# Altium schematic sheet IMU.SchDoc: =project_title
size Tabloid; CompanyName: Luxonis Holding; Organization: Luxonis Holding; Address1: 1925 Harmony Park Drive; Address2: Westminster, CO; Address3: 80234; Address4: United States; SheetNumber: 9; SheetTotal: 14
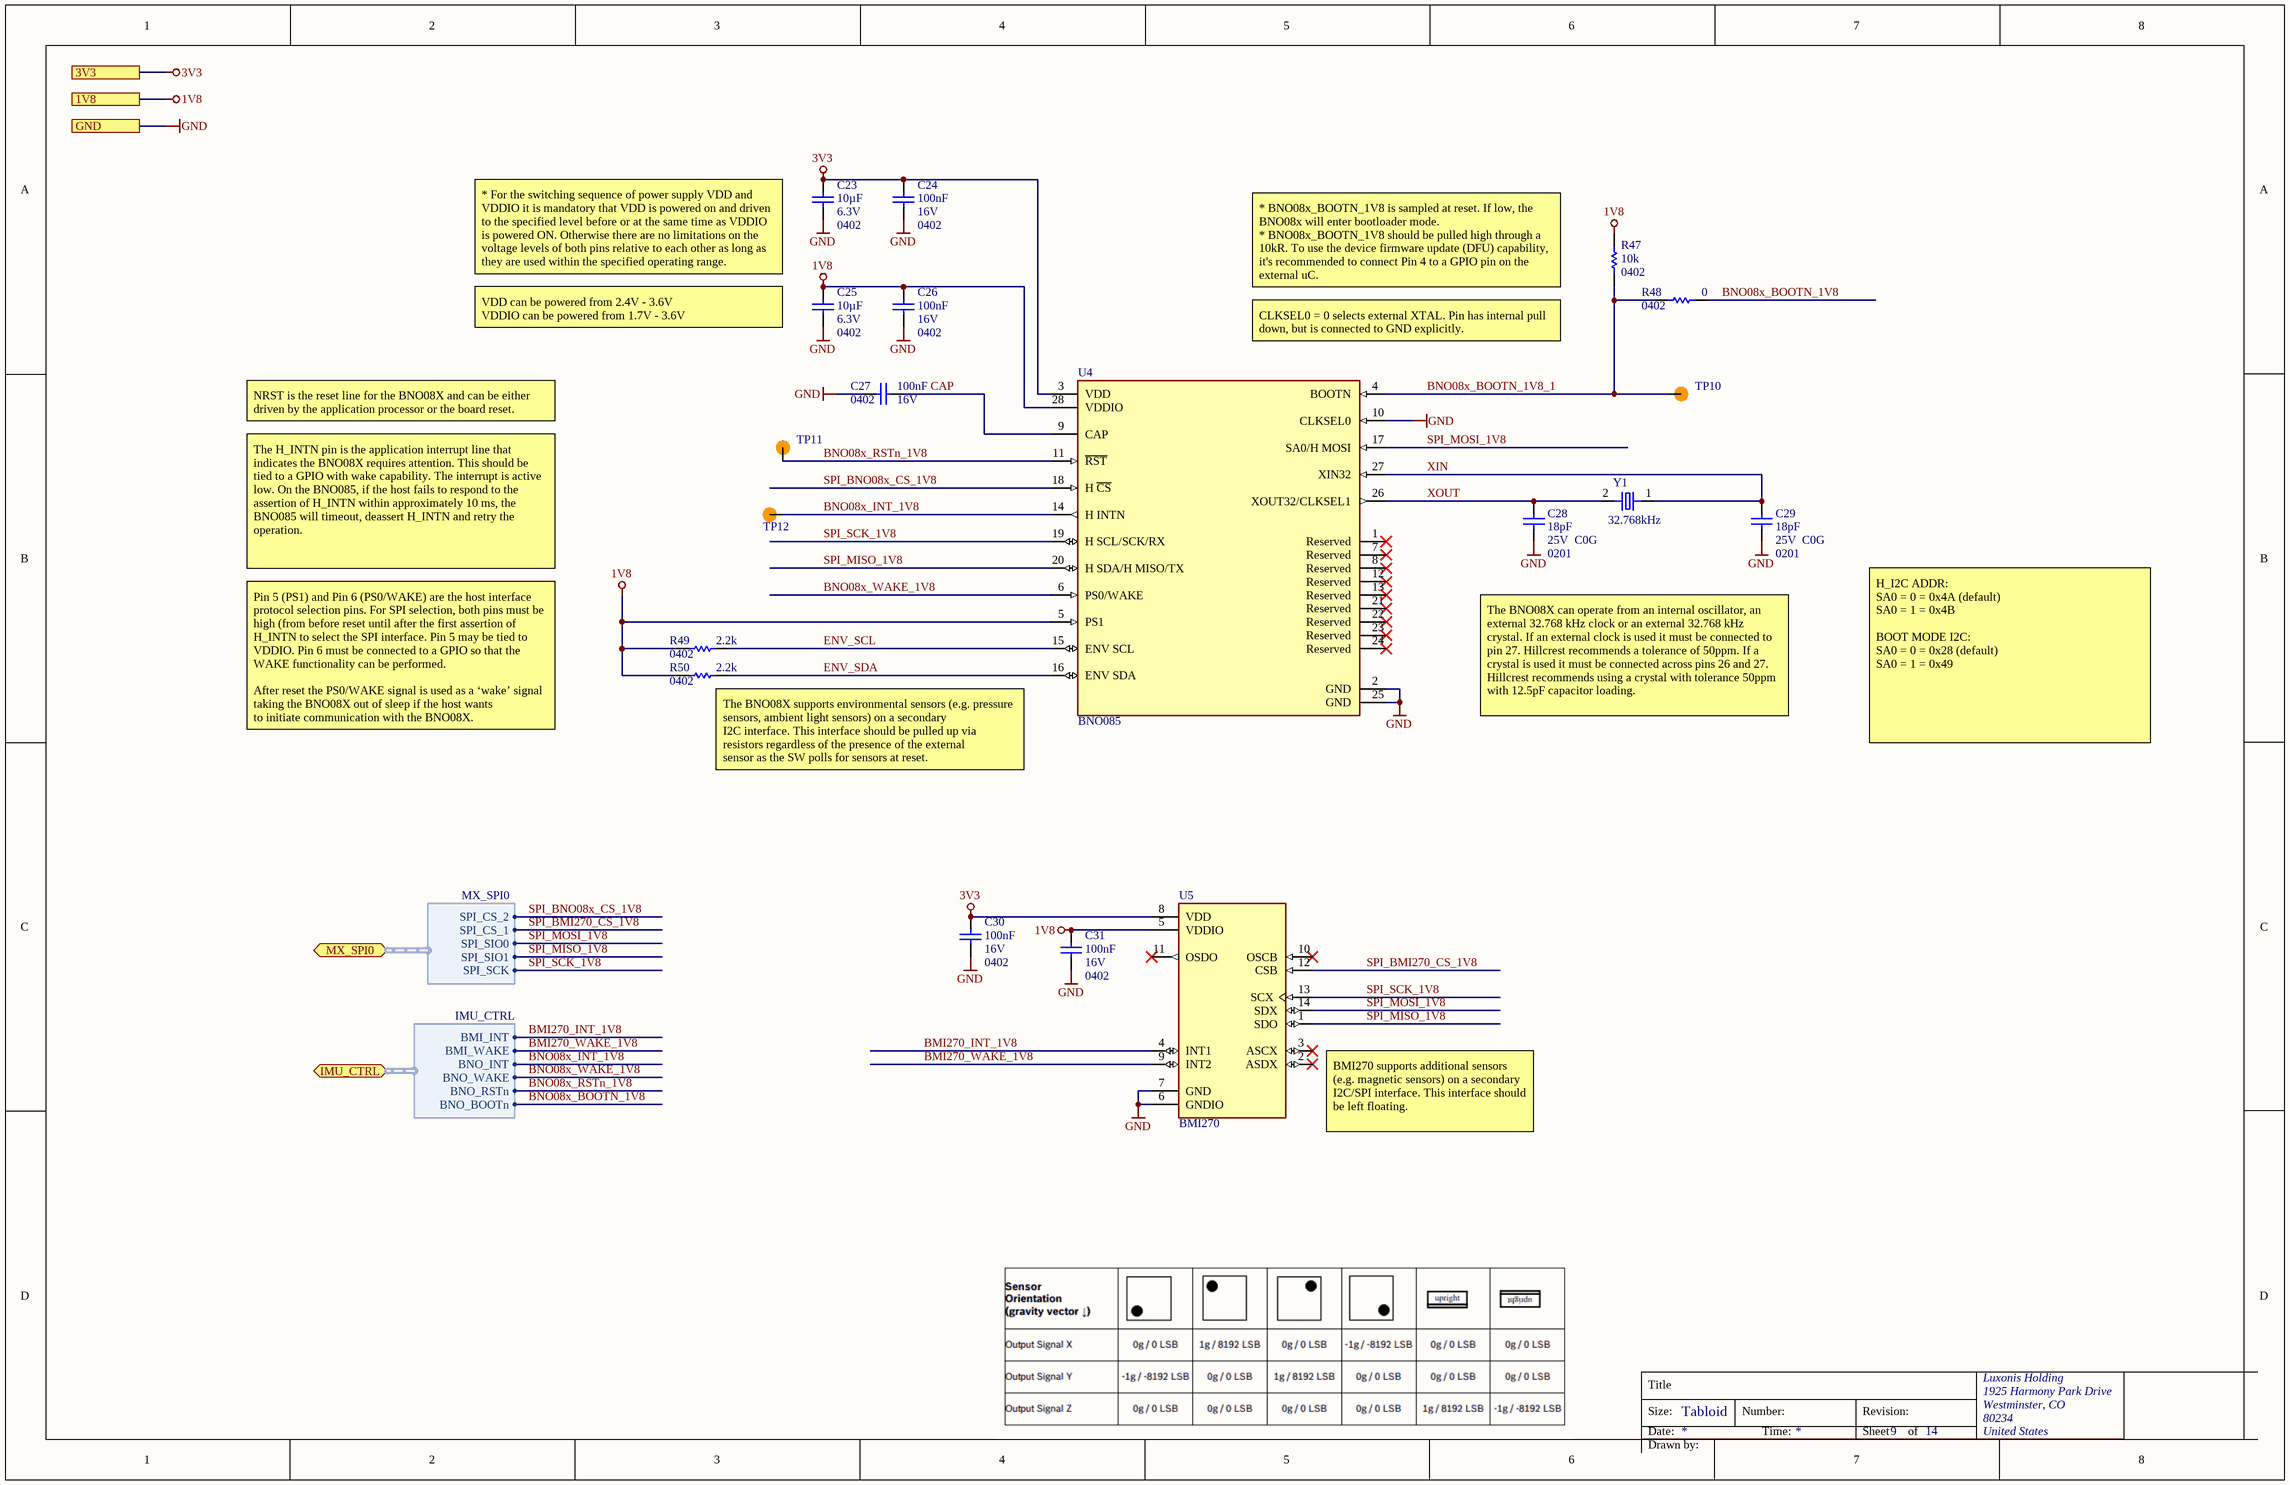
[diagram p0: IMU.SchDoc]

## Parts
C23  value 10µF  Voltage Rating: 6.3V  Case/Package: 0402  [CAPC0402(1005)70_N]  (hidden comment: GRM155R60J106ME15D)
C24  value 100nF  Voltage Rating: 16V  Case/Package: 0402  [CAPC0402(1005)60_N]  (hidden comment: CL05B104KO5NFNC)
C25  value 10µF  Voltage Rating: 6.3V  Case/Package: 0402  [CAPC0402(1005)70_N]  (hidden comment: GRM155R60J106ME15D)
C26  value 100nF  Voltage Rating: 16V  Case/Package: 0402  [CAPC0402(1005)60_N]  (hidden comment: CL05B104KO5NFNC)
C27  value 100nF  Voltage Rating: 16V  Case/Package: 0402  [CAPC0402(1005)60_N]  (hidden comment: CL05B104KO5NFNC)
C28  value 18pF  Case/Package: 0201  Voltage Rating: 25V  Dielectric: C0G  [CAPC0201(0603)33_L]  (hidden comment: GRM0335C1E180FA01D)
C29  value 18pF  Case/Package: 0201  Voltage Rating: 25V  Dielectric: C0G  [CAPC0201(0603)33_L]  (hidden comment: GRM0335C1E180FA01D)
C30  value 100nF  Voltage Rating: 16V  Case/Package: 0402  [CAPC0402(1005)60_N]  (hidden comment: CL05B104KO5NFNC)
C31  value 100nF  Voltage Rating: 16V  Case/Package: 0402  [CAPC0402(1005)60_N]  (hidden comment: CL05B104KO5NFNC)
R47  value 10k  Case/Package: 0402  [RESC0402(1005)_N]  (hidden comment: RC0402FR-1310KL)
R48  value 0  Case/Package: 0402  [RESC0402(1005)_L]  (hidden comment: CRCW04020000Z0ED)
R49  value 2.2k  Case/Package: 0402  [RESC0402(1005)_L]  (hidden comment: RC0402FR-072K2L)
R50  value 2.2k  Case/Package: 0402  [RESC0402(1005)_L]  (hidden comment: RC0402FR-072K2L)
TP10  TEST_POINT  [TP075_150_NS]  (value not drawn)  (no BOM)
TP11  TEST_POINT  [TP075_150_NS]  (value not drawn)  (no BOM)
TP12  TEST_POINT  [TP075_150_NS]  (value not drawn)  (no BOM)
U4  BNO085  [BNO085]
U5  BMI270  [XDCR_BMI270]
Y1  Frequency: 32.768kHz  [ABS06-127-32.768KHZ-T]  (hidden comment: ABS06-127-32.768KHZ-T)

## Ports
1V8, 3V3, GND, IMU_CTRL (bidir, harness IMU_CTRL), MX_SPI0 (bidir, harness MX_SPI0)

## Harnesses
MX_SPI0: SPI_SIO0, SPI_SIO1, SPI_CS_1, SPI_SCK, SPI_CS_2
IMU_CTRL: BMI_INT, BMI_WAKE, BNO_INT, BNO_WAKE, BNO_RSTn, BNO_BOOTn

## Nets
1V8: C25.2 C26.2 C31.2 R47.2 R49.1 R50.1 U4.5(PS1) U4.28(VDDIO) U5.5(VDDIO) ; port 1V8
3V3: C23.2 C24.2 C30.2 U4.3(VDD) U5.8(VDD) ; port 3V3
GND: C23.1 C24.1 C25.1 C26.1 C27.2 C28.1 C29.1 C30.1 C31.1 U4.2(GND) U4.10(CLKSEL0) U4.25(GND) U5.6(GNDIO) U5.7(GND) ; port GND
BMI270_INT_1V8: U5.4(INT1) ; port IMU_CTRL.BMI_INT
BMI270_WAKE_1V8: U5.9(INT2) ; port IMU_CTRL.BMI_WAKE
BNO08x_BOOTN_1V8: R48.2 ; port IMU_CTRL.BNO_BOOTn
BNO08x_BOOTN_1V8_1: R47.1 R48.1 TP10.1 U4.4(BOOTN)
BNO08x_INT_1V8: TP12.1 U4.14(H_INTN) ; port IMU_CTRL.BNO_INT
BNO08x_RSTn_1V8: TP11.1 U4.11(~{RST}) ; port IMU_CTRL.BNO_RSTn
BNO08x_WAKE_1V8: U4.6(PS0/WAKE) ; port IMU_CTRL.BNO_WAKE
CAP: C27.1 U4.9(CAP)
ENV_SCL: R49.2 U4.15(ENV_SCL)
ENV_SDA: R50.2 U4.16(ENV_SDA)
SPI_BMI270_CS_1V8: U5.12(CSB) ; port MX_SPI0.SPI_CS_1
SPI_BNO08x_CS_1V8: U4.18(H_~{CS}) ; port MX_SPI0.SPI_CS_2
SPI_MISO_1V8: U4.20(H_SDA/H_MISO/TX) U5.1(SDO) ; port MX_SPI0.SPI_SIO1
SPI_MOSI_1V8: U4.17(SA0/H_MOSI) U5.14(SDX) ; port MX_SPI0.SPI_SIO0
SPI_SCK_1V8: U4.19(H_SCL/SCK/RX) U5.13(SCX) ; port MX_SPI0.SPI_SCK
XIN: C29.2 U4.27(XIN32) Y1.1
XOUT: C28.2 U4.26(XOUT32/CLKSEL1) Y1.2

Not connected (* = marked no-connect by the designer): U4 1(Reserved)* 7(Reserved)* 8(Reserved)* 12(Reserved)* 13(Reserved)* 21(Reserved)* 22(Reserved)* 23(Reserved)* 24(Reserved)*; U5 2(ASDX)* 3(ASCX)* 10(OSCB)* 11(OSDO)*

## Notes on the sheet
- * For the switching sequence of power supply VDD and VDDIO it is mandatory that VDD is powered on and driven to the specified level before or at the same time as VDDIO is powered ON. Otherwise there are no limitations on the voltage levels of both pins relative to each other as long as they are used within the specified operating range.
- * BNO08x_BOOTN_1V8 is sampled at reset. If low, the BNO08x will enter bootloader mode.
  * BNO08x_BOOTN_1V8 should be pulled high through a 10kR. To use the device firmware update (DFU) capability, it's recommended to connect Pin 4 to a GPIO pin on the external uC.
- (near C25) VDD can be powered from 2.4V - 3.6V
  VDDIO can be powered from 1.7V - 3.6V
- CLKSEL0 = 0 selects external XTAL. Pin has internal pull down, but is connected to GND explicitly.
- NRST is the reset line for the BNO08X and can be either driven by the application processor or the board reset.
- The H_INTN pin is the application interrupt line that indicates the BNO08X requires attention. This should be tied to a GPIO with wake capability. The interrupt is active low. On the BNO085, if the host fails to respond to the assertion of H_INTN within approximately 10 ms, the BNO085 will timeout, deassert H_INTN and retry the operation.
- Pin 5 (PS1) and Pin 6 (PS0/WAKE) are the host interface protocol selection pins. For SPI selection, both pins must be high (from before reset until after the first assertion of H_INTN to select the SPI interface. Pin 5 may be tied to VDDIO. Pin 6 must be connected to a GPIO so that the WAKE functionality can be performed.
  After reset the PS0/WAKE signal is used as a ‘wake’ signal taking the BNO08X out of sleep if the host wants
  to initiate communication with the BNO08X.
- (near R50) The BNO08X supports environmental sensors (e.g. pressure sensors, ambient light sensors) on a secondary
  I2C interface. This interface should be pulled up via resistors regardless of the presence of the external
  sensor as the SW polls for sensors at reset.
- The BNO08X can operate from an internal oscillator, an external 32.768 kHz clock or an external 32.768 kHz crystal. If an external clock is used it must be connected to pin 27. Hillcrest recommends a tolerance of 50ppm. If a crystal is used it must be connected across pins 26 and 27. Hillcrest recommends using a crystal with tolerance 50ppm with 12.5pF capacitor loading.
- H_I2C ADDR:
  SA0 = 0 = 0x4A (default)
  SA0 = 1 = 0x4B
  BOOT MODE I2C:
  SA0 = 0 = 0x28 (default)
  SA0 = 1 = 0x49
- (near U5) BMI270 supports additional sensors (e.g. magnetic sensors) on a secondary I2C/SPI interface. This interface should be left floating.
- Title
- Size:
- Date:
- Tabloid
- Number:
- Time:
- Revision:
- Sheet
- of
- Drawn by:

## Library data of the parts
C23 C25 = CMP-004-000009-5: CAP CER 10UF 6.3V X5R 0402 20%; Manufacturer 1: Murata; Dielectric: X5R; Manufacturer Part Number 1: GRM155R60J106ME15D; ComponentLink1URL: https://www.murata.com/~/media/webrenewal/support/library/catalog/products/capacitor/mlcc/c02e.ashx?la=en-us&src-supplier=Digi-Key; Design Item ID: GRM155R60J106ME15D; Tolerance: 20%; Width: 0.02inch; Length: 0.039inch; Mounting Technology: SMT; Min Operating Temperature: -55°C; Max Operating Temperature: 85°C; ComponentLink1Description: https://www.murata.com/~/media/webrenewal/support/library/catalog/products/capacitor/mlcc/c02e.ashx?la=en-us&src-supplier=Digi-Key
C24 C26 C27 C30 C31 = CMP-108-000002-6: CAP CER 0.1UF 16V X7R 0402 10%; Manufacturer 1: Samsung; ComponentLink1URL: https://datasheet.ciiva.com/25767/cl05b104ko5nfnc-25767124.pdf?src-supplier=Digi-Key; Length: 1mm; Design Item ID: CL05B104KO5NFNC; Tolerance: 10%; Min Operating Temperature: -55°C; Width: 0.02inch; Dielectric: X7R; ComponentLink1Description: https://datasheet.ciiva.com/25767/cl05b104ko5nfnc-25767124.pdf?src-supplier=Digi-Key; Height: 0.5mm; Depth: 0.5mm; Manufacturer Part Number 1: CL05B104KO5NFNC; Max Operating Temperature: 125°C; Mounting Technology: SMT
C28 C29 = CMP-004-000003-6: CAP CER 18PF 25V C0G 0201 10%; Manufacturer 1: Murata; Tolerance: 1%; Manufacturer Part Number 1: GRM0335C1E180FA01D; Min Operating Temperature: -55°C; Max Operating Temperature: 125°C; Length: 0.024inch; Height: 0.3mm; Width: 0.3mm; ComponentLink1URL: https://datasheet.ciiva.com/29538/partnumbering-e-01-29538328.pdf?src-supplier=Digi-Key; ComponentLink1Description: https://datasheet.ciiva.com/29538/partnumbering-e-01-29538328.pdf?src-supplier=Digi-Key; Design Item ID: GRM0335C1E180FA01D; Mounting Technology: SMT
R47 = CMP-115-000004-8: RES SMD 10K OHM 1% 1/16W 0402; Manufacturer 1: Yageo; Temperature Coefficient: 100ppm/°C; Power Rating: 62.5mW; Voltage Rating: 50V; Manufacturer Part Number 1: RC0402FR-1310KL; Min Operating Temperature: -55°C; Max Operating Temperature: 155°C; Tolerance: 1%; Design Item ID: RC0402FR-1310KL
R48 = CMP-013-000022-11: RES SMD 0 OHM 5% 1/16W 0402; Manufacturer 1: Vishay; Voltage Rating: 50V; Power Rating: 63mW; Max Operating Temperature: 155°C; Manufacturer Part Number 1: CRCW04020000Z0ED; Tolerance: 5%; Min Operating Temperature: -55°C; Design Item ID: CRCW04020000Z0ED
R49 R50 = CMP-013-000013-8: RES SMD 2.2K OHM 1% 1/16W 0402; Manufacturer 1: Yageo; Power Rating: 63mW; Voltage Rating: 50V; Manufacturer Part Number 1: RC0402FR-072K2L; Min Operating Temperature: -55°C; Max Operating Temperature: 155°C; Tolerance: 1%; Design Item ID: RC0402FR-072K2L
TP10-TP12 = CMP-015-000000-2: Manufacturer Part Number 1: /; Design Item ID: TEST_POINT; Source: LuxonisMaster.SchLib
U4 = CMP-016-000000-2: IMU ACCEL/GYRO/MAG I2C 32BIT; Manufacturer 1: Hillcrest Laboratories; Sensor Type: Accelerometer,Gyroscope,Magnetometer; Manufacturer Part Number 1: BNO085; Case/Package: LGA
U5 = BMI270: Accelerometer, Gyroscope, 6 Axis Sensor IÂ²C, SPI Output; Manufacturer 1: Bosch Sensortec; Price: None; SnapEDA_Link: https://www.snapeda.com/parts/BMI270/Bosch%20Sensortec/view-part/3595167/?ref=snap; Manufacturer Part Number 1: BMI270; Availability: Unavailable; Value: *; Package: LGA-14 Bosch Sensortec
Y1 = CMP-006-000001-2: CRYSTAL 32.768kHz ±20ppm Crystal 12.5pF 90 kOhms 2-SMD, No Lead; Manufacturer 1: Abracon; Manufacturer Part Number 1: ABS06-127-32.768KHZ-T; Case/Package: SMD/SMT; Min Operating Temperature: -40°C; Max Operating Temperature: 85°C; Tolerance: 20ppm